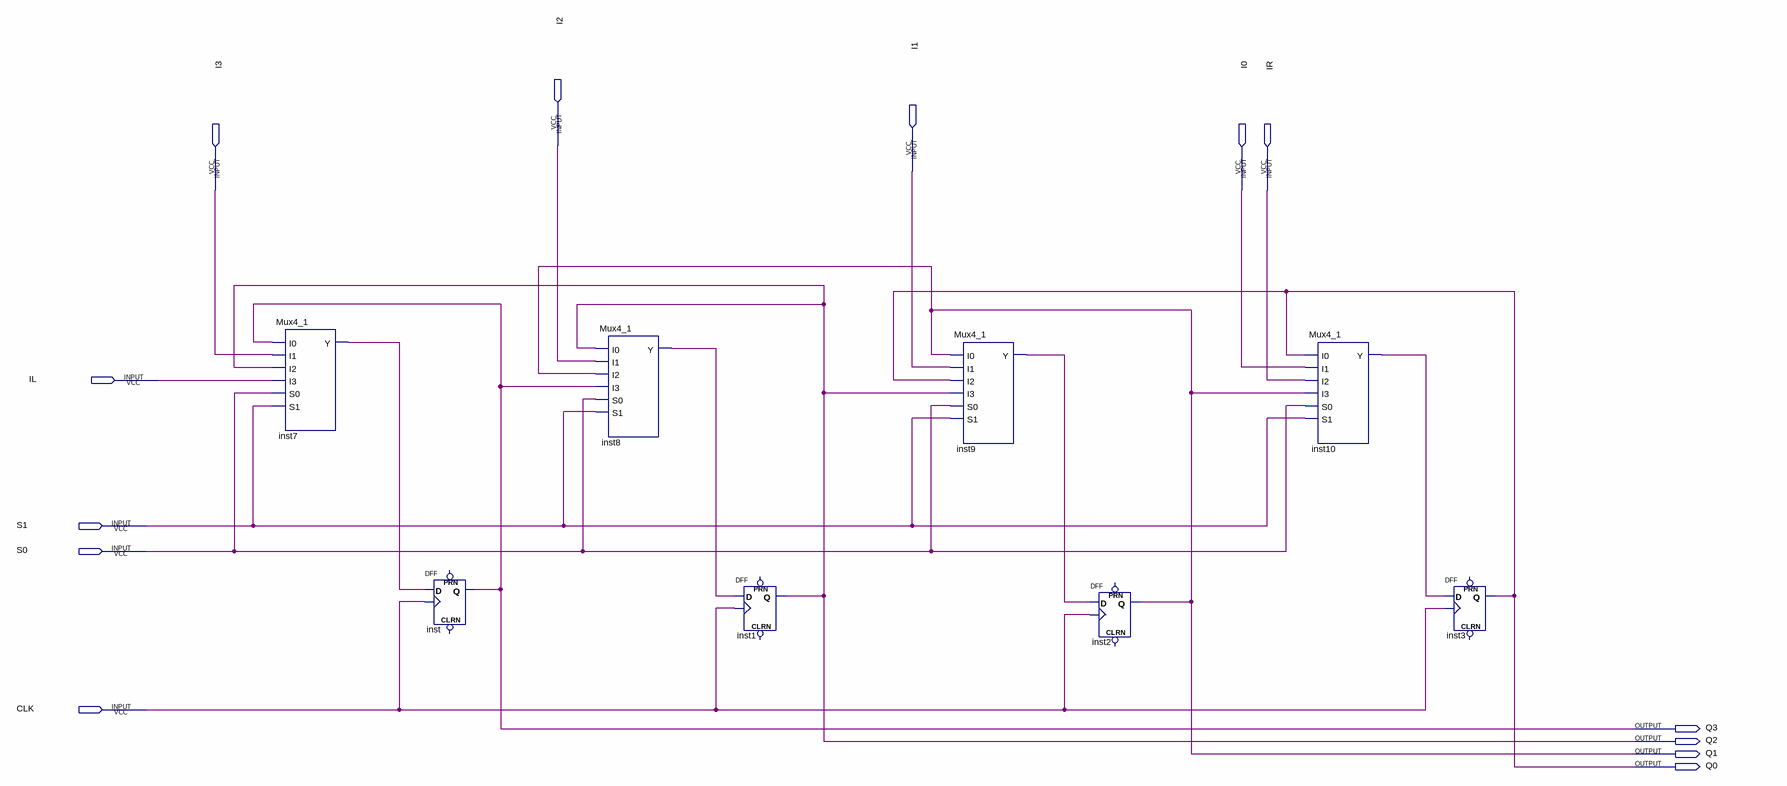
[diagram p0: schematic sheet]
// Quartus schematic SRwPL.bdf as structural Verilog: 8 symbols, 13 pins
module SRwPL (
  input  I2,
  input  I1,
  input  I3,
  input  I0,
  input  IR,
  input  IL,
  input  S1,
  input  S0,
  input  CLK,
  output Q3,
  output Q2,
  output Q1,
  output Q0
);

  wire inst7_y, inst8_y, inst9_y, inst10_y;

  Mux4_1 inst7 (.I0(Q3), .I1(I3), .I2(Q2), .I3(IL), .S0(S0), .S1(S1), .Y(inst7_y));
  DFF inst (.CLK(CLK), .D(inst7_y), .Q(Q3));  // open: CLRN, PRN
  Mux4_1 inst8 (.I0(Q2), .I1(I2), .I2(Q1), .I3(Q3), .S0(S0), .S1(S1), .Y(inst8_y));
  DFF inst1 (.CLK(CLK), .D(inst8_y), .Q(Q2));  // open: CLRN, PRN
  Mux4_1 inst9 (.I0(Q1), .I1(I1), .I2(Q0), .I3(Q2), .S0(S0), .S1(S1), .Y(inst9_y));
  DFF inst2 (.CLK(CLK), .D(inst9_y), .Q(Q1));  // open: CLRN, PRN
  Mux4_1 inst10 (.I0(Q0), .I1(I0), .I2(IR), .I3(Q1), .S0(S0), .S1(S1), .Y(inst10_y));
  DFF inst3 (.CLK(CLK), .D(inst10_y), .Q(Q0));  // open: CLRN, PRN
endmodule
